# Altium project Wi-Fi Radio.PrjPcb (part 1 of 3)
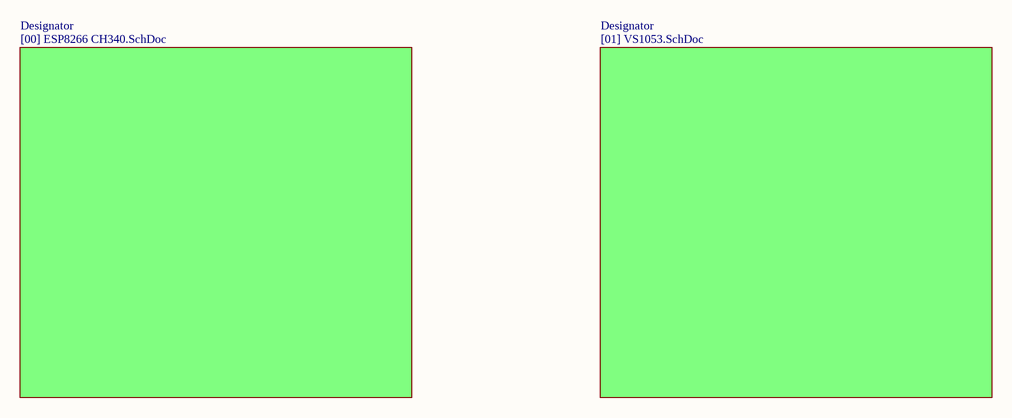
[diagram p0: Wi-Fi Radio.SchDoc]
3 sheets, 105 parts. Net scope: flat (ports and power ports of the same name join across sheets).
Board file: Wi-FiR.PcbDoc
Sheets:
  Wi-Fi Radio.SchDoc
    Designator = [00] ESP8266 CH340.SchDoc
    Designator = [01] VS1053.SchDoc

## Sheet Wi-Fi Radio.SchDoc
size A

### Sub-sheets
Designator = [00] ESP8266 CH340.SchDoc: no entries
Designator = [01] VS1053.SchDoc: no entries

## Sheet [00] ESP8266 CH340.SchDoc
size A4
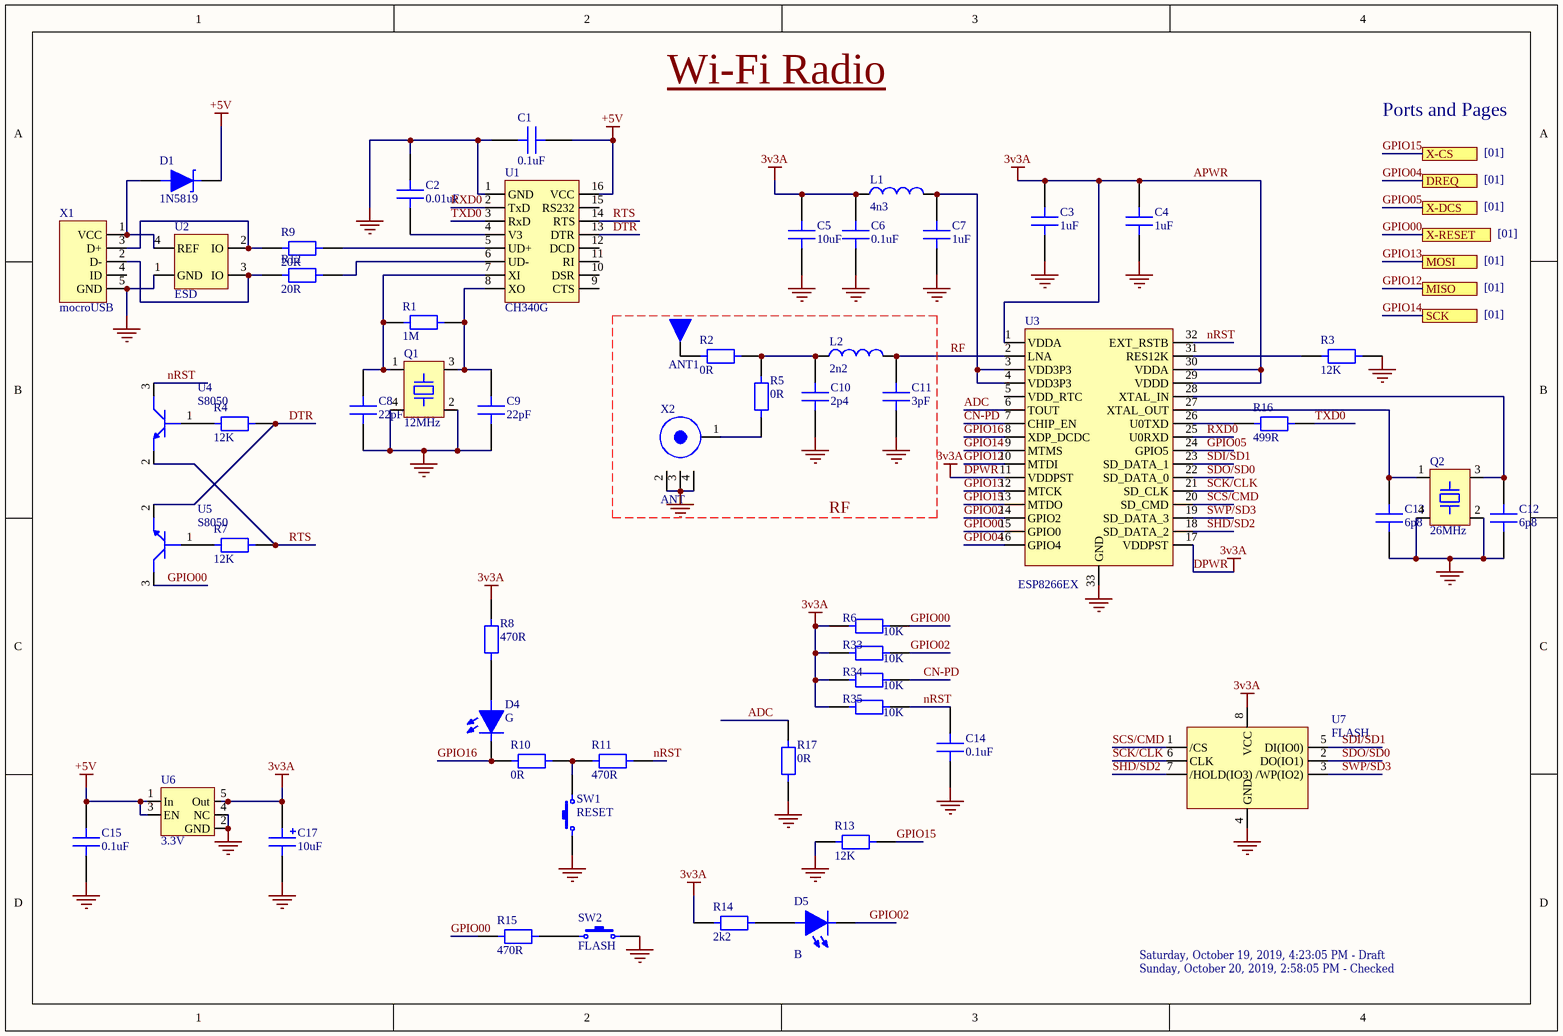
[diagram p1: [00] ESP8266 CH340.SchDoc]

### Parts
ANT1  ANT  [PIFA]  (value not drawn)  (no BOM)
C1  0.1uF  [CAP 0805]
C2  0.01uF  [CAP 0603]
C3  1uF  [CAP 0603]
C4  1uF  [CAP 0603]
C5  10uF  [CAP 0603]
C6  0.1uF  [CAP 0603]
C7  1uF  [CAP 0603]
C8  22pF  [CAP 0603]
C9  22pF  [CAP 0603]
C10  2p4  [CAP 0402]
C11  3pF  [CAP 0402]
C12  6p8  [CAP 0603]
C13  6p8  [CAP 0603]
C14  0.1uF  [CAP 0603]
C15  0.1uF  [CAP 0805]
C17  10uF  [CAP 1206]
D1  1N5819  [SOD123 Diode]
D4  G  [LED 0603]
D5  B  [LED 0603]
L1  4n3  [IND 0603 LQW]
L2  2n2  [IND 0402]
Q1  12MHz  [ABM8W]
Q2  26MHz  [ABM8W]
R1  1M  [RES 0603]
R2  0R  [RES 0405 - Jumper]
R3  12K  [RES 0603]
R4  12K  [RES 0603]
R5  0R  [RES 0405 - Jumper]
R6  10K  [RES 0603]
R7  12K  [RES 0603]
R8  470R  [RES 0603]
R9  20R  [RES 0603]
R10  0R  [RES 0603 - Jumper]
R11  470R  [RES 0603]
R12  20R  [RES 0603]
R13  12K  [RES 0603]
R14  2k2  [RES 0603]
R15  470R  [RES 0603]
R16  499R  [RES 0603]
R17  0R  [RES 0603 - Jumper]
R33  10K  [RES 0603]
R34  10K  [RES 0603]
R35  10K  [RES 0603]
SW1  RESET  [SWITCH MICRO]
SW2  FLASH  [SWITCH MICRO]
U1  CH340G  [SOP-16]
U2  ESD  [SOT143]
U3  ESP8266EX  [QFN-32 Thermal]
U4  S8050  [SOT-23]
U5  S8050  [SOT-23]
U6  3.3V  [SOT-23-5]
U7  FLASH  [SOIC-8 208-mil]
X1  mocroUSB  [microUSB]
X2  ANT  [U.FL Connector]

### Ports
DREQ, MISO, MOSI, SCK, X-CS, X-DCS, X-RESET

### Nets
+5V: C1.2 C15.2 D1.2 U1.16(VCC) U6.1(In) U6.3(EN)
APWR: C3.2 C4.2 C5.2 C6.2 C17.1 L1.1 R6.1 R8.2 R14.1 R33.1 R34.1 R35.1 U3.1(VDDA) U3.11(VDDPST) U3.17(VDDPST) U3.29(VDDD) U3.30(VDDA) U6.5(Out) U7.8(VCC)  [also labelled 3v3A, DPWR]
GND: C1.1 C2.2 C3.1 C4.1 C5.1 C6.1 C7.1 C8.1 C9.1 C10.1 C11.1 C12.1 C13.1 C14.1 C15.1 C17.2 Q1.2(GND) Q1.4(GND) Q2.2(GND) Q2.4(GND) R3.2 R13.1 R17.1 SW1.1 SW2.2 U1.1(GND) U2.1(GND) U3.33(GND) U6.2(GND) U6.4(NC) U7.4(GND) X1.5(GND) X2.2 X2.3(GND) X2.4
ADC: R17.2 U3.6(TOUT)
CN-PD: R34.2 U3.7(CHIP_EN)
DTR: R4.2 U1.13(DTR) U5.2
GPIO00: R6.2 R15.1 U3.15(GPIO0) U5.3 ; port X-RESET
GPIO02: D5.2 R33.2 U3.14(GPIO2)
GPIO04: U3.16(GPIO4) ; port DREQ
GPIO05: U3.24(GPIO5) ; port X-DCS
GPIO12: U3.10(MTDI) ; port MISO
GPIO13: U3.12(MTCK) ; port MOSI
GPIO14: U3.9(MTMS) ; port SCK
GPIO15: R13.2 U3.13(MTDO) ; port X-CS
GPIO16: D4.2 R10.1 U3.8(XDP_DCDC)
nRST: C14.2 R11.2 R35.2 U3.32(EXT_RSTB) U4.3
RF: C11.2 L2.2 U3.2(LNA)
RTS: R7.2 U1.14(RTS) U4.2
RXD0: U1.2(TxD) U3.25(U0RXD)
SCK/CLK: U3.21(SD_CLK) U7.6(CLK)
SCS/CMD: U3.20(SD_CMD) U7.1(/CS)
SDI/SD1: U3.23(SD_DATA_1) U7.5(DI(IO0))
SDO/SD0: U3.22(SD_DATA_0) U7.2(DO(IO1))
SHD/SD2: U3.18(SD_DATA_2) U7.7(/HOLD(IO3))
SWP/SD3: U3.19(SD_DATA_3) U7.3(/WP(IO2))
TXD0: R16.2 U1.3(RxD)
NetANT1_1: ANT1.1 R2.1
NetC2_1: C2.1 U1.4(V3)
NetC7_2: C7.2 L1.2 U3.3(VDD3P3) U3.4(VDD3P3)
NetC8_2: C8.2 Q1.1 R1.1 U1.7(XI)
NetC9_2: C9.2 Q1.3 R1.2 U1.8(XO)
NetC10_2: C10.2 L2.1 R2.2 R5.2
NetC12_2: C12.2 Q2.3 U3.28(XTAL_IN)
NetC13_2: C13.2 Q2.1 U3.27(XTAL_OUT)
NetD1_1: D1.1 U2.4(REF) X1.1(VCC)
NetD4_1: D4.1 R8.1
NetD5_1: D5.1 R14.2
NetR3_1: R3.1 U3.31(RES12K)
NetR4_1: R4.1 U4.1
NetR5_1: R5.1 X2.1
NetR7_1: R7.1 U5.1
NetR9_1: R9.1 U2.2(IO) X1.3(D+)
NetR9_2: R9.2 U1.5(UD+)
NetR10_2: R10.2 R11.1 SW1.2
NetR12_1: R12.1 U2.3(IO) X1.2(D-)
NetR12_2: R12.2 U1.6(UD-)
NetR15_2: R15.2 SW2.1
NetR16_1: R16.1 U3.26(U0TXD)

Not connected (* = marked no-connect by the designer): U1 9(CTS) 10(DSR) 11(RI) 12(DCD) 15(RS232); U3 5(VDD_RTC); X1 4(ID)

### Notes on the sheet
- USB Serial
- Wi-Fi Radio
- ESP8266EX
- Ports and Pages
- [01]
- RF
- I/O Bias
- Flash
- Power
- Sunday, ‎October ‎20, ‎2019, ‏‎2:58:05 PM - Checked
- Saturday, ‎October ‎19, ‎2019, ‏‎4:23:05 PM - Draft